# Altium project bias_sensor.PrjPcb
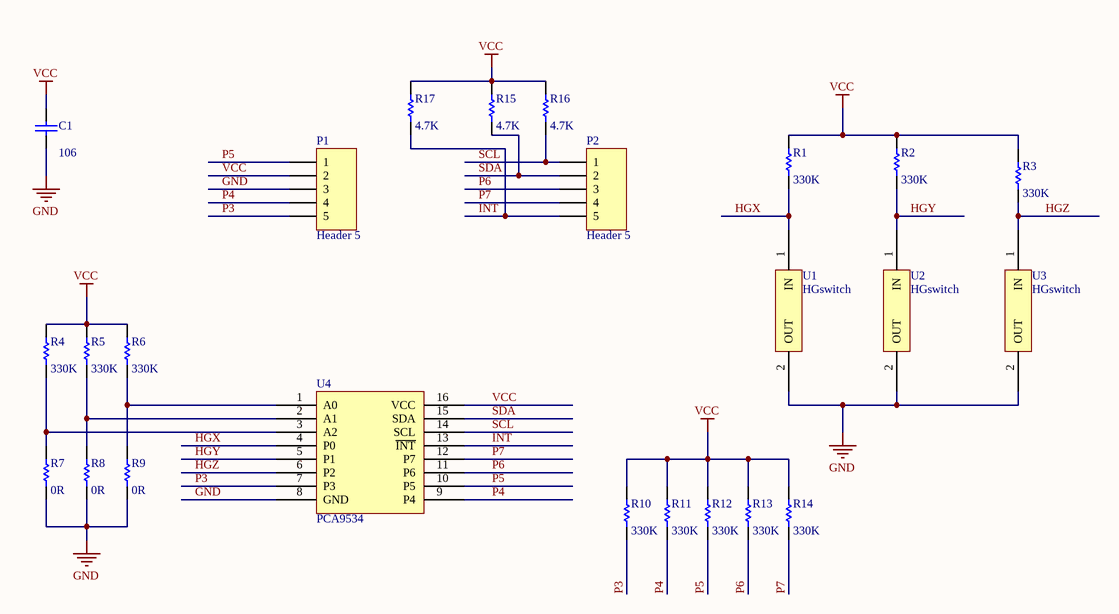
[diagram p0: Main.SchDoc]
1 sheet, 24 parts. Net scope: global (net labels, ports and power ports of the same name join across sheets).
Board file: Main.PcbDoc

## Sheet Main.SchDoc
size A4

### Parts
C1  106  [0603C]
P1  Header 5  [HDR1X5]
P2  Header 5  [HDR1X5]
R1  value 330K  [0603R]  (hidden comment: Res1)
R2  value 330K  [0603R]  (hidden comment: Res1)
R3  value 330K  [0603R]  (hidden comment: Res1)
R4  value 330K  [0603R]  (hidden comment: Res1)
R5  value 330K  [0603R]  (hidden comment: Res1)
R6  value 330K  [0603R]  (hidden comment: Res1)
R7  value 0R  [0603R]  (hidden comment: Res1)
R8  value 0R  [0603R]  (hidden comment: Res1)
R9  value 0R  [0603R]  (hidden comment: Res1)
R10  value 330K  [0603R]  (hidden comment: Res1)
R11  value 330K  [0603R]  (hidden comment: Res1)
R12  value 330K  [0603R]  (hidden comment: Res1)
R13  value 330K  [0603R]  (hidden comment: Res1)
R14  value 330K  [0603R]  (hidden comment: Res1)
R15  value 4.7K  [0603R]  (hidden comment: Res1)
R16  value 4.7K  [0603R]  (hidden comment: Res1)
R17  value 4.7K  [0603R]  (hidden comment: Res1)
U1  HGswitch  [HG-H]
U2  HGswitch  [HG-H]
U3  HGswitch  [HG-V]
U4  PCA9534  [TSSOP16]

### Nets
GND: C1.1 P1.3 R7.1 R8.1 R9.1 U1.2(OUT) U2.2(OUT) U3.2(OUT) U4.8(GND)
VCC: C1.2 P1.2 R1.2 R2.2 R3.2 R4.2 R5.2 R6.2 R10.2 R11.2 R12.2 R13.2 R14.2 R15.2 R16.2 R17.2 U4.16(VCC)
HGX: R1.1 U1.1(IN) U4.4(P0)
HGY: R2.1 U2.1(IN) U4.5(P1)
HGZ: R3.1 U3.1(IN) U4.6(P2)
INT: P2.5 R17.1 U4.13(~{INT})
P3: P1.5 R10.1 U4.7(P3)
P4: P1.4 R11.1 U4.9(P4)
P5: P1.1 R12.1 U4.10(P5)
P6: P2.3 R13.1 U4.11(P6)
P7: P2.4 R14.1 U4.12(P7)
SCL: P2.1 R16.1 U4.14(SCL)
SDA: P2.2 R15.1 U4.15(SDA)
NetR4_1: R4.1 R7.2 U4.3(A2)
NetR5_1: R5.1 R8.2 U4.2(A1)
NetR6_1: R6.1 R9.2 U4.1(A0)

### Library data of the parts
C1 = Cap: Capacitor; Published: 8-Jun-2000; LatestRevisionDate: 17-Jul-2002; LatestRevisionNote: Re-released for DXP Platform.; PackageReference: RAD-0.3; Publisher: Altium Limited; PackageDescription: Radial Cap, Thru-Hole; 2 Leads; 0.3 in Pin Spacing; Value: 106
P1 P2 = Header 5: Header, 5-Pin; LatestRevisionDate: 17-Jul-2002; LatestRevisionNote: Re-released for DXP Platform.; Publisher: Altium Limited
R1-R17 = Res1: Resistor; Published: 8-Jun-2000; LatestRevisionDate: 17-Jul-2002; LatestRevisionNote: Re-released for DXP Platform.; PackageReference: AXIAL-0.3; Publisher: Altium Limited; PackageDescription: Axial Device, Thru-Hole; 2 Leads; 0.3 in Pin Spacing